# Altium schematic sheet Auxiliary_Horn.SchDoc
size OrCAD A
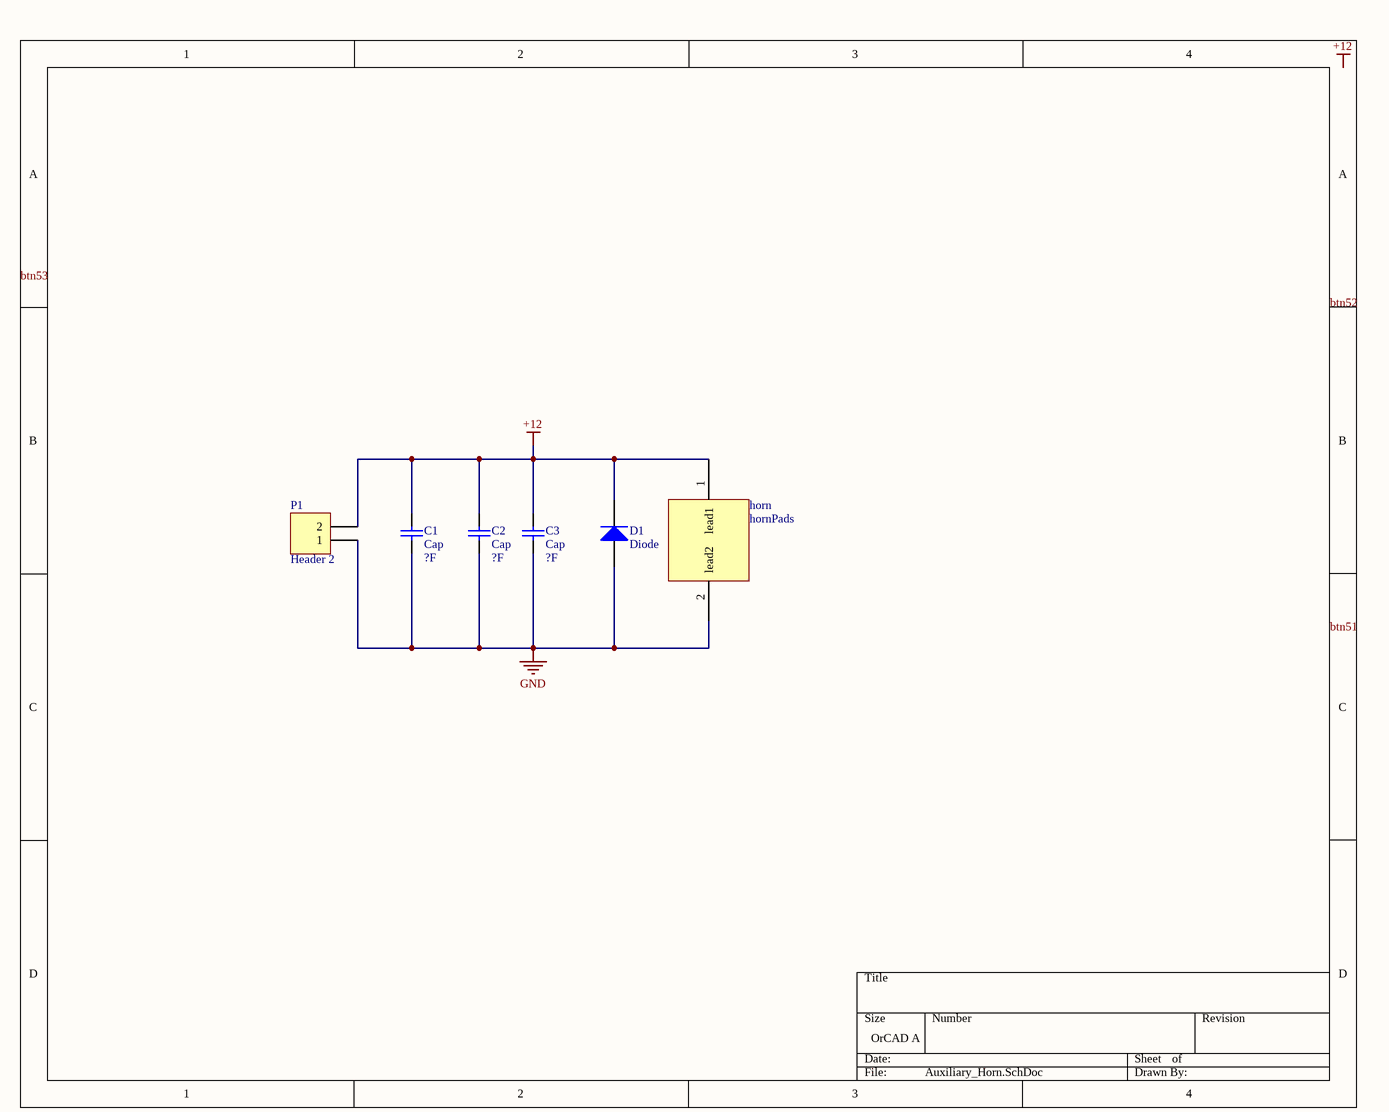
[diagram p0: Auxiliary_Horn.SchDoc]

## Parts
C1  Cap  value ?F  [RAD-0.3]
C2  Cap  value ?F  [RAD-0.3]
C3  Cap  value ?F  [RAD-0.3]
D1  Diode  [SMC]
horn  hornPads  [Horn_Pads]
P1  Header 2  [HDR1X2]

## Nets
+12: C1.2 C2.2 C3.2 D1.2(K) horn.1(lead1) P1.2
GND: C1.1 C2.1 C3.1 D1.1(A) horn.2(lead2) P1.1

## Notes on the sheet
- Labels drawn without touching a wire or pin: +12, btn51, btn52, btn53

## Library data of the parts
C1-C3 = Cap: Capacitor; Published: 8-Jun-2000; LatestRevisionDate: 17-Jul-2002; LatestRevisionNote: Re-released for DXP Platform.; PackageReference: RAD-0.3; Publisher: Altium Limited; PackageDescription: Radial Cap, Thru-Hole; 2 Leads; 0.3 in Pin Spacing
D1 = Diode: Default Diode; Published: 8-Jun-2000; LatestRevisionDate: 17-Jul-2002; LatestRevisionNote: Re-released for DXP Platform.; PackageVersion: Sep-1996; PackageReference: SMC; Publisher: Altium Limited; PackageDescription: DO-214-AB/SMC; 2 C-Bend Leads; Body 7.9 x 5.9 mm, inc. leads (LxW); Code_JEDEC: DO-214-AB
P1 = Header 2: Header, 2-Pin; LatestRevisionDate: 17-Jul-2002; LatestRevisionNote: Re-released for DXP Platform.; Publisher: Altium Limited